# Altium schematic sheet AMC_FMC_Carrier.SchDoc
size A4; DocumentNumber: 2; SheetNumber: 2; SheetTotal: 30
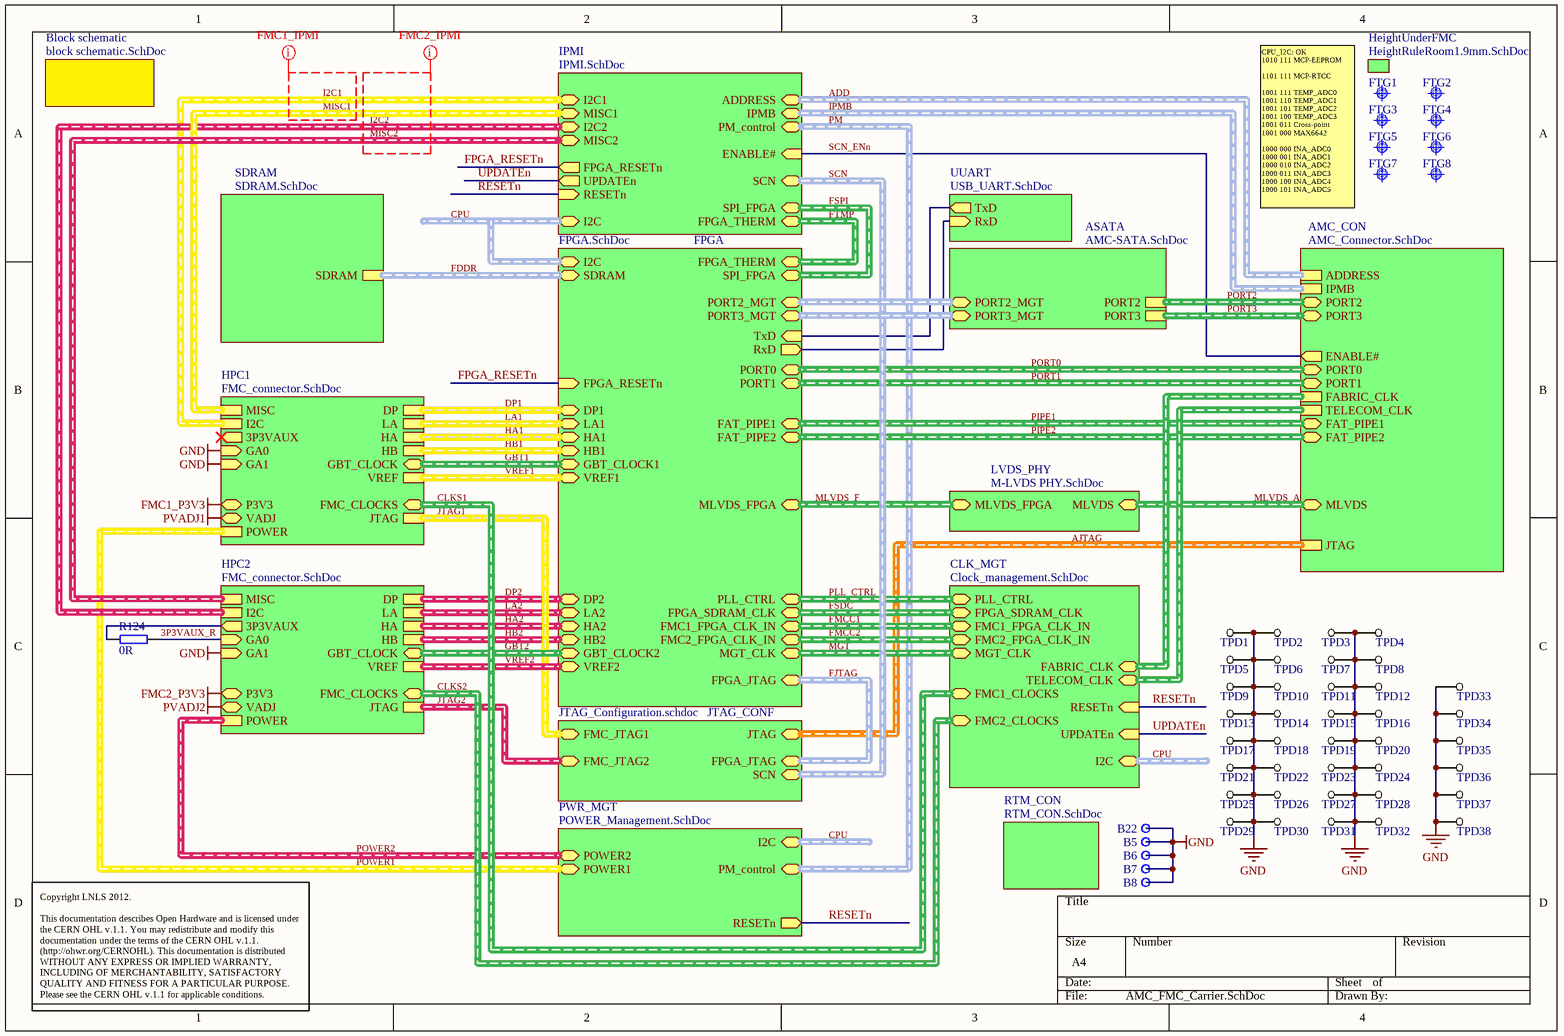
[diagram p0: AMC_FMC_Carrier.SchDoc]

## Parts
B5  Test Point  [VERO_20-2136]  (value not drawn)
B6  Test Point  [VERO_20-2136]  (value not drawn)
B7  Test Point  [VERO_20-2136]  (value not drawn)
B8  Test Point  [VERO_20-2136]  (value not drawn)
B22  Test Point  [VERO_20-2136]  (value not drawn)
FTG1  Use only in PCB  [FIDUCIAL_TOP_S100-200]  (value not drawn)
FTG2  Use only in PCB  [FIDUCIAL_TOP_C100-200]  (value not drawn)
FTG3  Use only in PCB  [FIDUCIAL_TOP_S100-200]  (value not drawn)
FTG4  Use only in PCB  [FIDUCIAL_TOP_C100-200]  (value not drawn)
FTG5  Use only in PCB  [FIDUCIAL_TOP_S100-200]  (value not drawn)
FTG6  Use only in PCB  [FIDUCIAL_TOP_C100-200]  (value not drawn)
FTG7  Use only in PCB  [FIDUCIAL_TOP_S100-200]  (value not drawn)
FTG8  Use only in PCB  [FIDUCIAL_TOP_C100-200]  (value not drawn)
R124  0R  [0402R]
TPD1  Test Point  [TP_DIFF_0805]  (value not drawn)
TPD2  Test Point  [TP_DIFF_0805]  (value not drawn)
TPD3  Test Point  [TP_DIFF_0805]  (value not drawn)
TPD4  Test Point  [TP_DIFF_0805]  (value not drawn)
TPD5  Test Point  [TP_DIFF_0805]  (value not drawn)
TPD6  Test Point  [TP_DIFF_0805]  (value not drawn)
TPD7  Test Point  [TP_DIFF_0805]  (value not drawn)
TPD8  Test Point  [TP_DIFF_0805]  (value not drawn)
TPD9  Test Point  [TP_DIFF_0805]  (value not drawn)
TPD10  Test Point  [TP_DIFF_0805]  (value not drawn)
TPD11  Test Point  [TP_DIFF_0805]  (value not drawn)
TPD12  Test Point  [TP_DIFF_0805]  (value not drawn)
TPD13  Test Point  [TP_DIFF_0805]  (value not drawn)
TPD14  Test Point  [TP_DIFF_0805]  (value not drawn)
TPD15  Test Point  [TP_DIFF_0805]  (value not drawn)
TPD16  Test Point  [TP_DIFF_0805]  (value not drawn)
TPD17  Test Point  [TP_DIFF_0805]  (value not drawn)
TPD18  Test Point  [TP_DIFF_0805]  (value not drawn)
TPD19  Test Point  [TP_DIFF_0805]  (value not drawn)
TPD20  Test Point  [TP_DIFF_0805]  (value not drawn)
TPD21  Test Point  [TP_DIFF_0805]  (value not drawn)
TPD22  Test Point  [TP_DIFF_0805]  (value not drawn)
TPD23  Test Point  [TP_DIFF_0805]  (value not drawn)
TPD24  Test Point  [TP_DIFF_0805]  (value not drawn)
TPD25  Test Point  [TP_DIFF_0805]  (value not drawn)
TPD26  Test Point  [TP_DIFF_0805]  (value not drawn)
TPD27  Test Point  [TP_DIFF_0805]  (value not drawn)
TPD28  Test Point  [TP_DIFF_0805]  (value not drawn)
TPD29  Test Point  [TP_DIFF_0805]  (value not drawn)
TPD30  Test Point  [TP_DIFF_0805]  (value not drawn)
TPD31  Test Point  [TP_DIFF_0805]  (value not drawn)
TPD32  Test Point  [TP_DIFF_0805]  (value not drawn)
TPD33  Test Point  [TP_DIFF_0805]  (value not drawn)
TPD34  Test Point  [TP_DIFF_0805]  (value not drawn)
TPD35  Test Point  [TP_DIFF_0805]  (value not drawn)
TPD36  Test Point  [TP_DIFF_0805]  (value not drawn)
TPD37  Test Point  [TP_DIFF_0805]  (value not drawn)
TPD38  Test Point  [TP_DIFF_0805]  (value not drawn)

## Sub-sheets
AMC_CON = AMC_Connector.SchDoc: JTAG (harness AMC_JTAG), TELECOM_CLK (harness AMC_TELECOM_CLOCK), ADDRESS (harness AMC_ADD), FABRIC_CLK (harness AMC_FABRIC_CLOCK), IPMB (harness I2C), ENABLE# (out), PORT0 (harness PORT0), PORT1 (harness PORT1), PORT2 (harness PORT2), PORT3 (harness PORT3), FAT_PIPE1 (harness FAT_PIPE1), FAT_PIPE2 (harness FAT_PIPE2), MLVDS (harness MLVDS)
ASATA = AMC-SATA.SchDoc: PORT2 (harness PORT2), PORT3 (harness PORT3), PORT2_MGT (harness PORT2), PORT3_MGT (harness PORT3)
Block schematic = block schematic.SchDoc: no entries
CLK_MGT = Clock_management.SchDoc: FABRIC_CLK (harness AMC_FABRIC_CLOCK), TELECOM_CLK (harness AMC_TELECOM_CLOCK), FMC1_CLOCKS (harness FMC_CLOCKS), FMC2_CLOCKS (harness FMC_CLOCKS), MGT_CLK (harness MGT_CLK), FMC1_FPGA_CLK_IN (harness FMC_FPGA_CLK_IN), FMC2_FPGA_CLK_IN (harness FMC_FPGA_CLK_IN), FPGA_SDRAM_CLK (harness FPGA_SDRAM_CLK), PLL_CTRL (harness PLL_CTRL), RESETn (in), UPDATEn (in), I2C (harness I2C)
FPGA = FPGA.SchDoc: SDRAM (harness DDR), FPGA_JTAG (harness FMC_J1_JTAG), VREF2 (harness FMC_J1_VREF), VREF1 (harness FMC_J1_VREF), FPGA_THERM (harness FPGA_THERM), SPI_FPGA (harness SPI), FAT_PIPE1, FAT_PIPE2, PORT1, PORT0, MLVDS_FPGA, GBT_CLOCK1, GBT_CLOCK2, MGT_CLK, FMC1_FPGA_CLK_IN, FMC2_FPGA_CLK_IN, FPGA_SDRAM_CLK, PLL_CTRL (harness PLL_CTRL), FPGA_RESETn (in), I2C (harness I2C), LA1, HA1, HB1, LA2, HA2, HB2, DP1, DP2, PORT2_MGT, PORT3_MGT, RxD (out), TxD (in)
HeightUnderFMC = HeightRuleRoom1.9mm.SchDoc: no entries
HPC1 = FMC_connector.SchDoc: DP (harness FMC_J1_DP), LA (harness FMC_J1_LA), HA (harness FMC_J1_HA), HB (harness FMC_J1_HB), MISC (harness MISC), POWER (harness FMC_J1_POWER), JTAG (harness FMC_J1_JTAG), I2C (harness I2C), GA0 (in), GA1 (in), 3P3VAUX (out), VREF (harness FMC_J1_VREF), FMC_CLOCKS (harness FMC_CLOCKS), GBT_CLOCK (harness GBT_CLOCK), VADJ, P3V3
HPC2 = FMC_connector.SchDoc: DP (harness FMC_J1_DP), LA (harness FMC_J1_LA), HA (harness FMC_J1_HA), HB (harness FMC_J1_HB), MISC (harness MISC), POWER (harness FMC_J1_POWER), JTAG (harness FMC_J1_JTAG), I2C (harness I2C), VREF (harness FMC_J1_VREF), GA0 (in), GA1 (in), 3P3VAUX (out), FMC_CLOCKS (harness FMC_CLOCKS), GBT_CLOCK (harness GBT_CLOCK), VADJ, P3V3
IPMI = IPMI.SchDoc: I2C1 (harness I2C), I2C2 (harness I2C), IPMB (harness I2C), ADDRESS (harness AMC_ADD), MISC1 (harness MISC), MISC2 (harness MISC), PM_control (harness pm_control), FPGA_THERM (harness FPGA_THERM), SPI_FPGA (harness SPI), ENABLE# (in), UPDATEn (out), RESETn (in), I2C (harness I2C), SCN (harness SCN), FPGA_RESETn (out)
JTAG_CONF = JTAG_Configuration.schdoc: FMC_JTAG1 (harness FMC_J1_JTAG), FMC_JTAG2 (harness FMC_J1_JTAG), JTAG (harness AMC_JTAG), FPGA_JTAG (harness FMC_J1_JTAG), SCN (harness SCN)
LVDS_PHY = M-LVDS PHY.SchDoc: MLVDS (harness MLVDS), MLVDS_FPGA (harness MLVDS-FPGA)
PWR_MGT = POWER_Management.SchDoc: POWER1 (harness FMC_J1_POWER), POWER2 (harness FMC_J1_POWER), PM_control (harness PM_control), RESETn (out), I2C (harness I2C)
RTM_CON = RTM_CON.SchDoc: no entries
SDRAM = SDRAM.SchDoc: SDRAM (harness DDR)
UUART = USB_UART.SchDoc: TxD (out), RxD (in)

## Nets
FMC1_P3V3: sheet HPC1/P3V3
FMC2_P3V3: sheet HPC2/P3V3
GND: B5.1 B6.1 B7.1 B8.1 B22.1 TPD1.1(TP) TPD2.1(TP) TPD3.1(TP) TPD4.1(TP) TPD5.1(TP) TPD6.1(TP) TPD7.1(TP) TPD8.1(TP) TPD9.1(TP) TPD10.1(TP) TPD11.1(TP) TPD12.1(TP) TPD13.1(TP) TPD14.1(TP) TPD15.1(TP) TPD16.1(TP) TPD17.1(TP) TPD18.1(TP) TPD19.1(TP) TPD20.1(TP) TPD21.1(TP) TPD22.1(TP) TPD23.1(TP) TPD24.1(TP) TPD25.1(TP) TPD26.1(TP) TPD27.1(TP) TPD28.1(TP) TPD29.1(TP) TPD30.1(TP) TPD31.1(TP) TPD32.1(TP) TPD33.1(TP) TPD34.1(TP) TPD35.1(TP) TPD36.1(TP) TPD37.1(TP) TPD38.1(TP) ; sheet HPC1/GA0, sheet HPC1/GA1, sheet HPC2/GA1
PVADJ1: sheet HPC1/VADJ
PVADJ2: sheet HPC2/VADJ
3P3VAUX_R: R124.2 ; sheet HPC2/GA0
FPGA_RESETn: sheet FPGA/FPGA_RESETn, sheet IPMI/FPGA_RESETn
RESETn: sheet PWR_MGT/RESETn, sheet IPMI/RESETn, sheet CLK_MGT/RESETn
SCN_ENn: sheet AMC_CON/ENABLE#, sheet IPMI/ENABLE#
UPDATEn: sheet IPMI/UPDATEn, sheet CLK_MGT/UPDATEn
NetR124_1: R124.1 ; sheet HPC2/3P3VAUX
(unnamed): sheet FPGA/RxD, sheet UUART/RxD
(unnamed): sheet FPGA/TxD, sheet UUART/TxD

## Buses and harness runs
harness ADD = sheet AMC_CON/ADDRESS = sheet IPMI/ADDRESS
harness AJTAG = sheet AMC_CON/JTAG = sheet JTAG_CONF/JTAG
harness CLKS1 = sheet CLK_MGT/FMC1_CLOCKS = sheet HPC1/FMC_CLOCKS
harness CLKS2 = sheet CLK_MGT/FMC2_CLOCKS = sheet HPC2/FMC_CLOCKS
harness CPU = sheet CLK_MGT/I2C
harness CPU = sheet FPGA/I2C = sheet IPMI/I2C
harness CPU = sheet PWR_MGT/I2C
harness DP1 = sheet FPGA/DP1 = sheet HPC1/DP
harness DP2 = sheet FPGA/DP2 = sheet HPC2/DP
harness FDDR = sheet FPGA/SDRAM = sheet SDRAM/SDRAM
harness FJTAG = sheet FPGA/FPGA_JTAG = sheet JTAG_CONF/FPGA_JTAG
harness FMCC1 = sheet CLK_MGT/FMC1_FPGA_CLK_IN = sheet FPGA/FMC1_FPGA_CLK_IN
harness FMCC2 = sheet CLK_MGT/FMC2_FPGA_CLK_IN = sheet FPGA/FMC2_FPGA_CLK_IN
harness FSDC = sheet CLK_MGT/FPGA_SDRAM_CLK = sheet FPGA/FPGA_SDRAM_CLK
harness FSPI = sheet FPGA/SPI_FPGA = sheet IPMI/SPI_FPGA
harness FTMP = sheet FPGA/FPGA_THERM = sheet IPMI/FPGA_THERM
harness GBT1 = sheet FPGA/GBT_CLOCK1 = sheet HPC1/GBT_CLOCK
harness GBT2 = sheet FPGA/GBT_CLOCK2 = sheet HPC2/GBT_CLOCK
harness HA1 = sheet FPGA/HA1 = sheet HPC1/HA
harness HA2 = sheet FPGA/HA2 = sheet HPC2/HA
harness HB1 = sheet FPGA/HB1 = sheet HPC1/HB
harness HB2 = sheet FPGA/HB2 = sheet HPC2/HB
harness I2C1 = sheet HPC1/I2C = sheet IPMI/I2C1
harness I2C2 = sheet HPC2/I2C = sheet IPMI/I2C2
harness IPMB = sheet AMC_CON/IPMB = sheet IPMI/IPMB
harness JTAG1 = sheet HPC1/JTAG = sheet JTAG_CONF/FMC_JTAG1
harness JTAG2 = sheet HPC2/JTAG = sheet JTAG_CONF/FMC_JTAG2
harness LA1 = sheet FPGA/LA1 = sheet HPC1/LA
harness LA2 = sheet FPGA/LA2 = sheet HPC2/LA
harness MGT = sheet CLK_MGT/MGT_CLK = sheet FPGA/MGT_CLK
harness MISC1 = sheet HPC1/MISC = sheet IPMI/MISC1
harness MISC2 = sheet HPC2/MISC = sheet IPMI/MISC2
harness MLVDS_A = sheet AMC_CON/MLVDS = sheet LVDS_PHY/MLVDS
harness MLVDS_F = sheet FPGA/MLVDS_FPGA = sheet LVDS_PHY/MLVDS_FPGA
harness PIPE1 = sheet AMC_CON/FAT_PIPE1 = sheet FPGA/FAT_PIPE1
harness PIPE2 = sheet AMC_CON/FAT_PIPE2 = sheet FPGA/FAT_PIPE2
harness PLL_CTRL = sheet CLK_MGT/PLL_CTRL = sheet FPGA/PLL_CTRL
harness PM = sheet IPMI/PM_control = sheet PWR_MGT/PM_control
harness PORT0 = sheet AMC_CON/PORT0 = sheet FPGA/PORT0
harness PORT1 = sheet AMC_CON/PORT1 = sheet FPGA/PORT1
harness PORT2 = sheet AMC_CON/PORT2 = sheet ASATA/PORT2
harness PORT3 = sheet AMC_CON/PORT3 = sheet ASATA/PORT3
harness POWER1 = sheet HPC1/POWER = sheet PWR_MGT/POWER1
harness POWER2 = sheet HPC2/POWER = sheet PWR_MGT/POWER2
harness SCN = sheet IPMI/SCN = sheet JTAG_CONF/SCN
harness sheet AMC_CON/FABRIC_CLK = sheet CLK_MGT/FABRIC_CLK
harness sheet AMC_CON/TELECOM_CLK = sheet CLK_MGT/TELECOM_CLK
harness sheet ASATA/PORT2_MGT = sheet FPGA/PORT2_MGT
harness sheet ASATA/PORT3_MGT = sheet FPGA/PORT3_MGT
harness VREF1 = sheet FPGA/VREF1 = sheet HPC1/VREF
harness VREF2 = sheet FPGA/VREF2 = sheet HPC2/VREF

## Layout directives
net class FMC1_IPMI: I2C1, MISC1
net class FMC2_IPMI: I2C2, MISC2

## Notes on the sheet
- CPU_I2C: OK
  1010 111 MCP-EEPROM
  1101 111 MCP-RTCC
  1001 111 TEMP_ADC0
  1001 110 TEMP_ADC1
  1001 101 TEMP_ADC2
  1001 100 TEMP_ADC3
  1001 011 Cross-point
  1001 000 MAX6642
  1000 000 INA_ADC0
  1000 001 INA_ADC1
  1000 010 INA_ADC2
  1000 011 INA_ADC3
  1000 100 INA_ADC4
  1000 101 INA_ADC5
- Copyright LNLS 2012.
  This documentation describes Open Hardware and is licensed under the CERN OHL v.1.1. You may redistribute and modify this documentation under the terms of the CERN OHL v.1.1. (http://ohwr.org/CERNOHL). This documentation is distributed WITHOUT ANY EXPRESS OR IMPLIED WARRANTY, INCLUDING OF MERCHANTABILITY, SATISFACTORY QUALITY AND FITNESS FOR A PARTICULAR PURPOSE. Please see the CERN OHL v.1.1 for applicable conditions.

## Library data of the parts
B5-B8 B22 = VERO_20-2136: Single Terminal Socket; Part Description: Black Bead PCB Terminal Test Pin (1.32 mm hole); Manufacturer: VERO TECHNOLOGIES; Table: Miscellaneous; Part Number: VERO_20-2136; Component Kind: Standard; Component Type: Standard; Pin Count: 1; Family: Test Point; Mounted: Yes; Socket: No; SMD: No; Status: None; Manufacturer Part Number: 20-2136; ComponentHeight: 5.3mm; HelpURL: \\cern.ch\dfs\Applications\Altium\Datasheets\VERO_20-2136.pdf; Author: CERN DEM JLC; CreateDate: 21/07/2008; LatestRevisionDate: 21/07/2008
FTG1 FTG3 FTG5 FTG7 = FIDUCIAL_TARGET_S100-200: Fiducial Target; Part Description: Square Fiducial Target, Top Layer, 1.0mm, Top Solder 2.0mm, Keepout =2.0mm; Mounted: No; Table: Pads; Part Number: FIDUCIAL_TARGET_S100-200; Component Kind: Standard (No BOM); Component Type: Standard (No BOM); Pin Count: 1; Family: Fiducial; Socket: No; SMD: Yes; Status: None; ComponentHeight: 0mm; Author: CERN DEM JLC; CreateDate: 2010-02-09; LatestRevisionDate: 2012-04-04; PackageDescription: Square Fiducial Target, Top Layer, 1.0mm, Top Solder 2.0mm, Keepout =2.0mm
FTG2 FTG4 FTG6 FTG8 = FIDUCIAL_TARGET_C100-200: Fiducial Target; Part Description: Round Fiducial Target, Top Layer, 1.0mm, Top Solder 2.0mm, Keepout =2.0mm; Mounted: No; Table: Pads; Part Number: FIDUCIAL_TARGET_C100-200; Component Kind: Standard (No BOM); Component Type: Standard (No BOM); Pin Count: 1; Family: Fiducial; Socket: No; SMD: Yes; Status: None; ComponentHeight: 0mm; Author: CERN DEM JLC; CreateDate: 2010-02-09; LatestRevisionDate: 2012-04-04; PackageDescription: Round Fiducial Target, Top Layer, 1.0mm, Top Solder 2.0mm, Keepout =2.0mm
R124 = RES_0402: SMD Resistor; Supplier 1: Newark; Supplier Part Number 1: 59M6691
TPD1-TPD38 = TP_DIFF: 1625854-2; Bottom_EstimationX (mm): 0; Document Name: AMC_FMC_Carrier.SchDoc; Part Number: TP_DIFF; ParamsList: Test Point; FootprintSizeX (mm): 4; FootprintSizeY (mm): 2; FootprintRectangleArea (mm): 8; Thickness (Max) (mm): 2; Bottom_EstimationY (mm): 0; Bottom_Area_Estimation (mm): 0; FootprintAlias: TP_SMD_0805